# Altium project pca10100.PrjPCB (part 1 of 4)
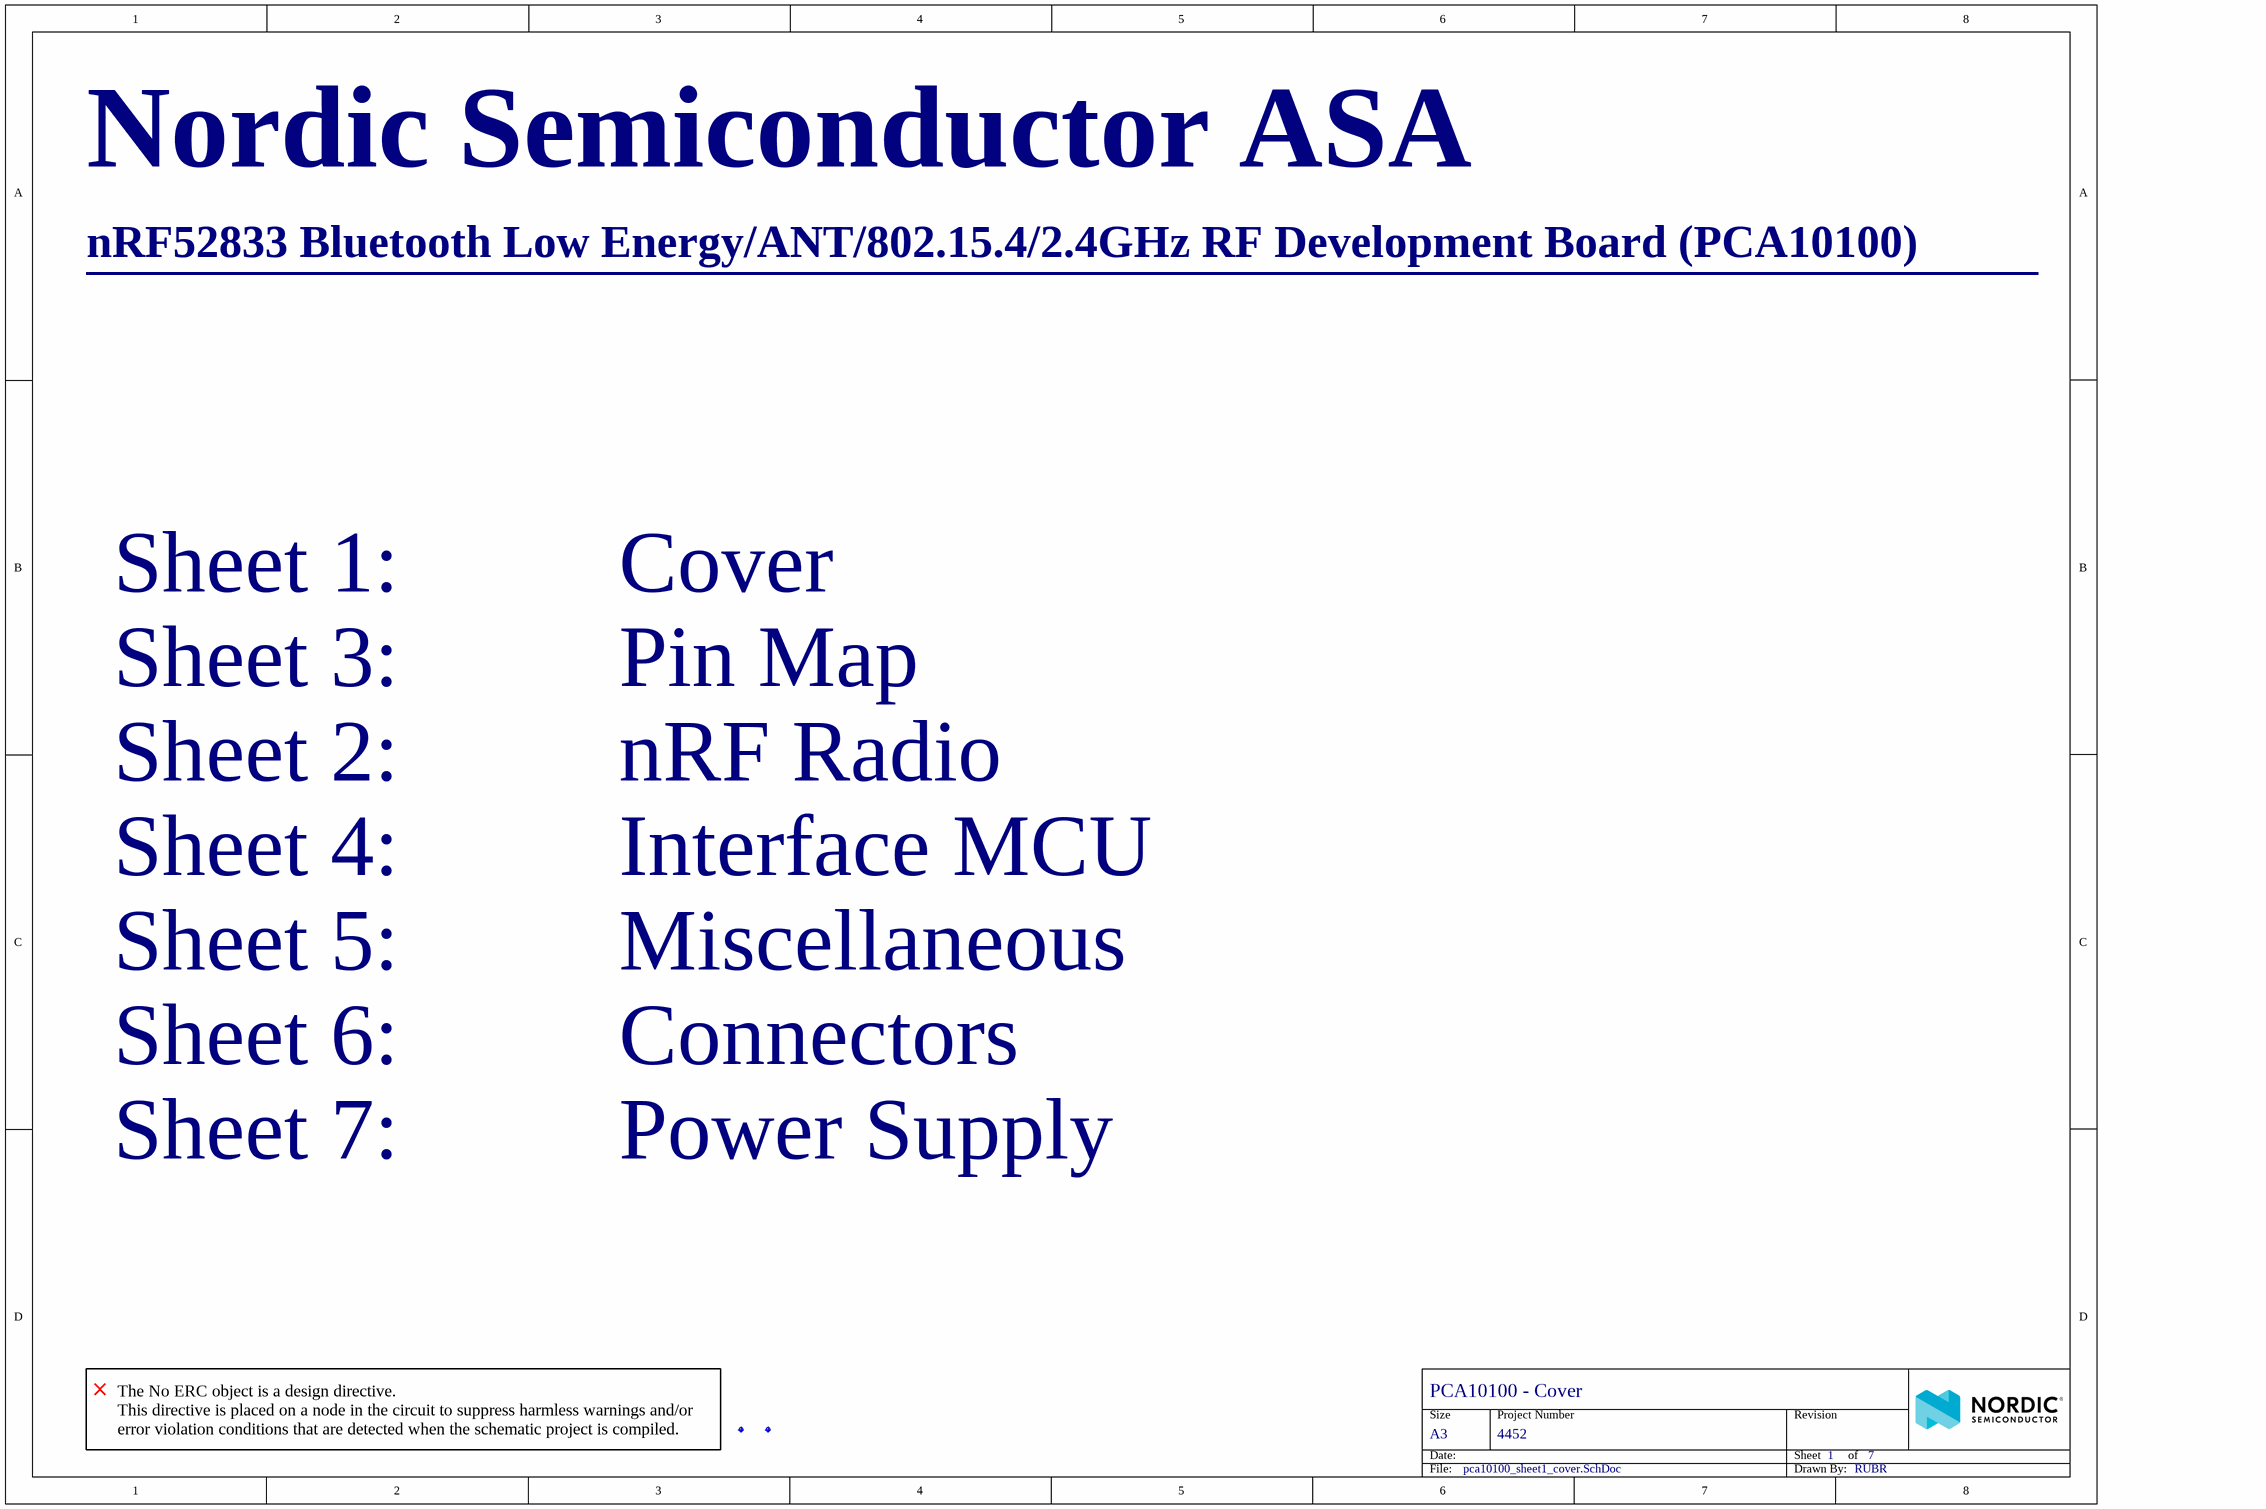
[diagram p0: pca10100_sheet1_cover.SchDoc]
Author: RUBR; BoardThickness: 1.6mm; BoardTitle: nRF52833 Bluetooth Smart/ANT/802.15.4/2.4GHz RF Development Board; NrOfLayers: 4; Organization: Nordic Semiconductor; PCAName: PCA10100; PCBNumber: 400442; PCBRevision: 0402RUBR; PCBStackup: 4001; ProjectNumber: 4452; Rev: 1.1.0; SilkscreenColor: White; SoldermaskColor: Blue; SurfaceFinish: ENIG Gold
7 sheets, 336 parts. Net scope: flat (ports and power ports of the same name join across sheets).
Board file: 400442.PcbDoc
Sheets:
  pca10100_sheet1_cover.SchDoc
  pca10100_sheet2_nrf52833_mcu.SchDoc
  pca10100_sheet3_pin_map.SchDoc
  pca10100_sheet4_interface_mcu.SchDoc
  pca10100_sheet5_misc.SchDoc
  pca10100_sheet6_connectors.SchDoc
  pca10100_sheet7_power_supply.SchDoc

## Sheet pca10100_sheet1_cover.SchDoc: PCA10100 - Cover
size A3; Organization: Nordic Semiconductor; DocumentNumber: 1; Revision: 1.1.0; SheetNumber: 1; SheetTotal: 7; Author: RUBR; CompanyName: Nordic Semiconductor; DrawnBy: RUBR

### Parts
Fid1  Fiducial mark  [Fiducial]  (value not drawn)
Fid2  Fiducial mark  [Fiducial]  (value not drawn)

### Notes on the sheet
- Nordic Semiconductor ASA
- nRF52833 Bluetooth Low Energy/ANT/802.15.4/2.4GHz RF Development Board (PCA10100)
- ________________________________________________________________
- Sheet 1:          Cover
- Sheet 3:          Pin Map
- Sheet 2:          nRF Radio
- Sheet 4:          Interface MCU
- Sheet 5:          Miscellaneous
- Sheet 6:          Connectors
- Sheet 7:          Power Supply
- (near Fid1) The No ERC object is a design directive.
  This directive is placed on a node in the circuit to suppress harmless warnings and/or error violation conditions that are detected when the schematic project is compiled.
- Size
- Date:
- A3
- Project Number
- Sheet         of
- Revision
- File:
- Drawn By:

### Library data of the parts
Fid1 Fid2 = Fid-Mark: Manufacturer: N.A.; Value: N.A.; Pad Count: 1; Part Number: Fid-Mark; Manufacturer Part Number: N.A.; LatestRevisionDate: 2009-12-12; Published: 2009-12-12; Note: N.A.; Artikkelnr Noca: N.A.; Footprint Doc: Fiducial; Part number IPS: N.A.; ComponentLink1URL: N.A.; ComponentLink1Description: Datasheet; ComponentLink2URL: N.A.; ComponentLink2Description: Supplier link; HelpURL: N.A.; Supplier 1: N.A.; Supplier Part Number 1: N.A.; Supplier 2: N.A.; Supplier Part Number 2: N.A.; Component Class: Connectors; PartId: 100500073

## Sheet pca10100_sheet2_nrf52833_mcu.SchDoc: PCA10100 - nRF52833 MCU
size A3; Organization: Nordic Semiconductor; DocumentNumber: 2; Revision: 1.1.0; SheetNumber: 2; SheetTotal: 7; Author: RUBR; CompanyName: Nordic Semiconductor; DrawnBy: RUBR
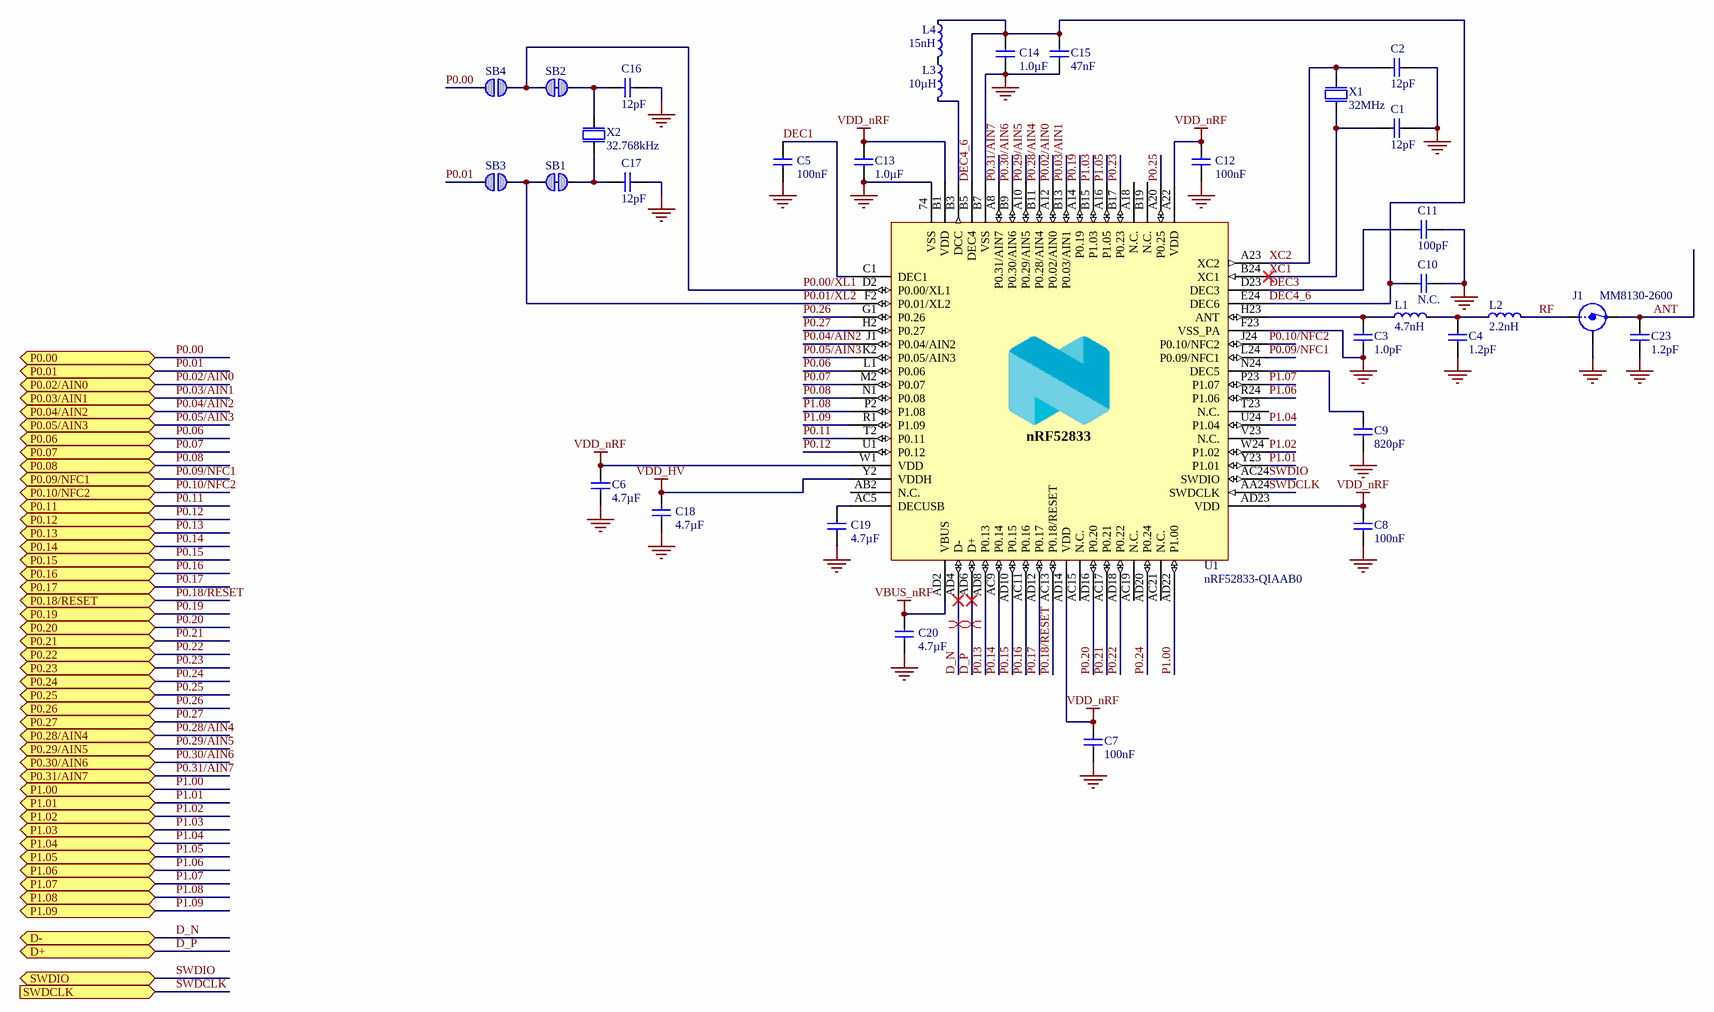
[diagram p1: pca10100_sheet2_nrf52833_mcu.SchDoc]

### Parts
C1  12pF  [CAPC1005X04L]
C2  12pF  [CAPC1005X04L]
C3  1.0pF  [CAPC1005X04L]
C4  1.2pF  [CAPC1005X04L]
C5  100nF  [CAPC1005X04L]
C6  4.7µF  [CAPC1608X06L]
C7  100nF  [CAPC1005X04L]
C8  100nF  [CAPC1005X04L]
C9  820pF  [CAPC1005X04L]
C10  N.C.  [CAPC1005X04L_NC]
C11  100pF  [CAPC1005X04L]
C12  100nF  [CAPC1005X04L]
C13  1.0µF  [CAPC1608X06L]
C14  1.0µF  [CAPC1608X06L]
C15  47nF  [CAPC1005X04L]
C16  12pF  [CAPC1005X04L]
C17  12pF  [CAPC1005X04L]
C18  4.7µF  [CAPC1608X06L]
C19  4.7µF  [CAPC1608X06L]
C20  4.7µF  [CAPC1608X06L]
C23  1.2pF  [CAPC1005X04L]
J1  MM8130-2600  [COAXIAL-SWF]
L1  4.7nH  [INDC1005X04L]
L2  2.2nH  [INDC1005X04L]
L3  10µH  [INDC1608X06L]
L4  15nH  [INDC1005X04L]
SB1  Solderbridge  [Solderbridge_Shorted]  (value not drawn)  (net tie, no BOM)
SB2  Solderbridge  [Solderbridge_Shorted]  (value not drawn)  (net tie, no BOM)
SB3  Solderbridge  [Solderbridge]  (value not drawn)  (no BOM)
SB4  Solderbridge  [Solderbridge]  (value not drawn)  (no BOM)
U1  nRF52833-QIAAB0  [AQFN50P700X700X85_HS-74N]
X1  32MHz  [BT-XTAL_2016]
X2  32.768kHz  [XTAL_3215]

### Ports
D+ (bidir), D- (bidir), P0.00 (bidir), P0.01 (bidir), P0.02/AIN0 (bidir), P0.03/AIN1 (bidir), P0.04/AIN2 (bidir), P0.05/AIN3 (bidir), P0.06 (bidir), P0.07 (bidir), P0.08 (bidir), P0.09/NFC1 (bidir), P0.10/NFC2 (bidir), P0.11 (bidir), P0.12 (bidir), P0.13 (bidir), P0.14 (bidir), P0.15 (bidir), P0.16 (bidir), P0.17 (bidir), P0.18/RESET (bidir), P0.19 (bidir), P0.20 (bidir), P0.21 (bidir), P0.22 (bidir), P0.23 (bidir), P0.24 (bidir), P0.25 (bidir), P0.26 (bidir), P0.27 (bidir), P0.28/AIN4 (bidir), P0.29/AIN5 (bidir), P0.30/AIN6 (bidir), P0.31/AIN7 (bidir), P1.00 (bidir), P1.01 (bidir), P1.02 (bidir), P1.03 (bidir), P1.04 (bidir), P1.05 (bidir), P1.06 (bidir), P1.07 (bidir), P1.08 (bidir), P1.09 (bidir), SWDCLK (in), SWDIO (bidir)

### Nets
GND: C1.2 C2.2 C3.1 C4.1 C5.2 C6.2 C7.2 C8.2 C9.2 C10.1 C11.2 C12.2 C13.2 C14.1 C15.2 C16.1 C17.1 C18.2 C19.2 C20.2 C23.2 J1.2(Shield) U1.74(VSS) U1.B7(VSS) U1.F23(VSS_PA) X1.2(GND) X1.4(GND)
VBUS_nRF: C20.1 U1.AD2(VBUS)
VDD_HV: C18.1 U1.Y2(VDDH)
VDD_nRF: C6.1 C7.1 C8.1 C12.1 C13.1 U1.A22(VDD) U1.AD14(VDD) U1.AD23(VDD) U1.B1(VDD) U1.W1(VDD)
ANT: C23.1 J1.3(OUT)
D_N: U1.AD4(D-) ; port D-  [project net D*_N]
D_P: U1.AD6(D+) ; port D+  [project net D*_P]
DEC1: C5.1 U1.C1(DEC1)
DEC3: C11.1 U1.D23(DEC3)
DEC4_6: C10.2 C14.2 C15.1 L4.1 U1.B5(DEC4) U1.E24(DEC6)
P0.00: SB4.2 ; port P0.00
P0.00/XL1: SB2.2 SB4.1 U1.D2(P0.00/XL1)
P0.01: SB3.2 ; port P0.01
P0.01/XL2: SB1.2 SB3.1 U1.F2(P0.01/XL2)
P0.02/AIN0: U1.A12(P0.02/AIN0) ; port P0.02/AIN0
P0.03/AIN1: U1.B13(P0.03/AIN1) ; port P0.03/AIN1
P0.04/AIN2: U1.J1(P0.04/AIN2) ; port P0.04/AIN2
P0.05/AIN3: U1.K2(P0.05/AIN3) ; port P0.05/AIN3
P0.06: U1.L1(P0.06) ; port P0.06
P0.07: U1.M2(P0.07) ; port P0.07
P0.08: U1.N1(P0.08) ; port P0.08
P0.09/NFC1: U1.L24(P0.09/NFC1) ; port P0.09/NFC1
P0.10/NFC2: U1.J24(P0.10/NFC2) ; port P0.10/NFC2
P0.11: U1.T2(P0.11) ; port P0.11
P0.12: U1.U1(P0.12) ; port P0.12
P0.13: U1.AD8(P0.13) ; port P0.13
P0.14: U1.AC9(P0.14) ; port P0.14
P0.15: U1.AD10(P0.15) ; port P0.15
P0.16: U1.AC11(P0.16) ; port P0.16
P0.17: U1.AD12(P0.17) ; port P0.17
P0.18/RESET: U1.AC13(P0.18/RESET) ; port P0.18/RESET
P0.19: U1.A14(P0.19) ; port P0.19
P0.20: U1.AD16(P0.20) ; port P0.20
P0.21: U1.AC17(P0.21) ; port P0.21
P0.22: U1.AD18(P0.22) ; port P0.22
P0.23: U1.B17(P0.23) ; port P0.23
P0.24: U1.AD20(P0.24) ; port P0.24
P0.25: U1.A20(P0.25) ; port P0.25
P0.26: U1.G1(P0.26) ; port P0.26
P0.27: U1.H2(P0.27) ; port P0.27
P0.28/AIN4: U1.B11(P0.28/AIN4) ; port P0.28/AIN4
P0.29/AIN5: U1.A10(P0.29/AIN5) ; port P0.29/AIN5
P0.30/AIN6: U1.B9(P0.30/AIN6) ; port P0.30/AIN6
P0.31/AIN7: U1.A8(P0.31/AIN7) ; port P0.31/AIN7
P1.00: U1.AD22(P1.00) ; port P1.00
P1.01: U1.Y23(P1.01) ; port P1.01
P1.02: U1.W24(P1.02) ; port P1.02
P1.03: U1.B15(P1.03) ; port P1.03
P1.04: U1.U24(P1.04) ; port P1.04
P1.05: U1.A16(P1.05) ; port P1.05
P1.06: U1.R24(P1.06) ; port P1.06
P1.07: U1.P23(P1.07) ; port P1.07
P1.08: U1.P2(P1.08) ; port P1.08
P1.09: U1.R1(P1.09) ; port P1.09
RF: J1.1(IN) L2.2
SWDCLK: U1.AA24(SWDCLK) ; port SWDCLK
SWDIO: U1.AC24(SWDIO) ; port SWDIO
XC1: C1.1 U1.B24(XC1) X1.1(inp)
XC2: C2.1 U1.A23(XC2) X1.3(out)
NetC3_2: C3.2 L1.1 U1.H23(ANT)
NetC4_2: C4.2 L1.2 L2.1
NetC9_1: C9.1 U1.N24(DEC5)
NetC16_2: C16.2 SB2.1 X2.1(inp)
NetC17_2: C17.2 SB1.1 X2.2(out)
NetC19_1: C19.1 U1.AC5(DECUSB)
NetL3_1: L3.1 L4.2
NetL3_2: L3.2 U1.B3(DCC)

Not connected (* = marked no-connect by the designer): U1 A18(N.C.) AB2(N.C.) AC15(N.C.) AC19(N.C.) AC21(N.C.) B19(N.C.) T23(N.C.) V23(N.C.)

### Layout directives
differential pair: D*_N, D*_P

### Notes on the sheet
- Size
- Date:
- A3
- Project Number
- Sheet         of
- Revision
- File:
- Drawn By:
- (in symbol nRF52833-QIAAB0) nRF52833

### Library data of the parts
C1 C2 C16 C17 = C0402-12p: Capacitor, NP0, ±2%; Manufacturer: N.A.; Part number IPS: 00000002398; Note: 50V; Artikkelnr Noca: 20029159; Pad Count: 2; Part Number: C0402-12p; LatestRevisionDate: 2011-05-11; Published: 2009-05-08; Value: 12pF; Footprint Doc: 0402; Manufacturer Part Number: N.A.; ComponentLink1URL: N.A.; ComponentLink1Description: Datasheet; ComponentLink2URL: N.A.; ComponentLink2Description: Supplier link; HelpURL: N.A.; Supplier 1: N.A.; Supplier Part Number 1: N.A.; Supplier 2: N.A.; Supplier Part Number 2: N.A.; Component Class: Capacitors; PartId: 100200137
C3 = C0402-1.0p: Capacitor, NP0, ±0.1pF; Manufacturer: N.A.; Part number IPS: 00000000301; Note: 50V; Artikkelnr Noca: 20029140; Pad Count: 2; Part Number: C0402-1.0p; LatestRevisionDate: 2020-04-28; Published: 2009-05-08; Value: 1.0pF; Footprint Doc: 0402; Manufacturer Part Number: N.A.; ComponentLink1URL: N.A.; ComponentLink1Description: Datasheet; ComponentLink2URL: N.A.; ComponentLink2Description: Supplier link; HelpURL: N.A.; Supplier 1: Digi-Key; Supplier Part Number 1: 490-6073-1-ND; Supplier 2: N.A.; Supplier Part Number 2: N.A.; Component Class: Capacitors; PartId: 100200118
C4 C23 = C0402-1.2p: Capacitor, NP0, ±0.1pF; Manufacturer: N.A.; Part number IPS: 00000005410; Note: 50V; Artikkelnr Noca: 20029157; Pad Count: 2; Part Number: C0402-1.2p; LatestRevisionDate: 2011-05-11; Published: 2009-05-08; Value: 1.2pF; Footprint Doc: 0402; Manufacturer Part Number: N.A.; ComponentLink1URL: N.A.; ComponentLink1Description: Datasheet; ComponentLink2URL: N.A.; ComponentLink2Description: Supplier link; HelpURL: N.A.; Supplier 1: N.A.; Supplier Part Number 1: N.A.; Supplier 2: N.A.; Supplier Part Number 2: N.A.; Component Class: Capacitors; PartId: 100200119
C5 C7 C8 C12 = C0402-100n: Capacitor, X7R, ±10%; Manufacturer: N.A.; Part number IPS: 00000005296; Note: 16V; Artikkelnr Noca: 20039200; Pad Count: 2; Part Number: C0402-100n; LatestRevisionDate: 2009-11-23; Published: 2009-05-08; Value: 100nF; Footprint Doc: 0402; Manufacturer Part Number: N.A.; ComponentLink1URL: N.A.; ComponentLink1Description: Datasheet; ComponentLink2URL: N.A.; ComponentLink2Description: Supplier link; HelpURL: N.A.; Supplier 1: N.A.; Supplier Part Number 1: N.A.; Supplier 2: N.A.; Supplier Part Number 2: N.A.; Component Class: Capacitors; PartId: 100200184
C6 C19 = C0603-4µ7-6.3V-X7R: Capacitor, X7R, ±10%, 6.3V; Manufacturer: Samsung Electro-Mechanics America; Manufacturer Part Number: CL10B475KQ8NQNC; Part number IPS: 00000002541; Artikkelnr Noca: 20039473; Pad Count: 2; Part Number: C0603-4µ7-6.3V-X7R; LatestRevisionDate: 2015-06-10; Published: 2015-06-10; Value: 4.7µF; Note: 6.3V; Footprint Doc: 0603; ComponentLink1URL: N.A.; ComponentLink1Description: Datasheet; ComponentLink2URL: N.A.; ComponentLink2Description: Supplier link; HelpURL: http://media.digikey.com/pdf/Data%20Sheets/Samsung%20PDFs/CL10B475KQ8NQNC_Spec.pdf; Supplier 1: Digi-Key; Supplier Part Number 1: 1276-2087-1-ND; Supplier 2: N.A.; Supplier Part Number 2: N.A.; Component Class: Capacitors; PartId: 100200350
C9 = C0402-820p: Capacitor, NP0, ±5%, 50V; Manufacturer: N.A.; Part number IPS: 00000004365; Artikkelnr Noca: 20029219; Pad Count: 2; Part Number: C0402-820p; LatestRevisionDate: 2020-10-13; Published: 2009-05-08; Value: 820pF; Note: 50V; Footprint Doc: 0402; Manufacturer Part Number: N.A.; ComponentLink1URL: N.A.; ComponentLink1Description: Datasheet; ComponentLink2URL: N.A.; ComponentLink2Description: Supplier link; HelpURL: N.A.; Supplier 1: N.A.; Supplier Part Number 1: N.A.; Supplier 2: N.A.; Supplier Part Number 2: N.A.; Component Class: Capacitors; PartId: 100200161
C10 = C0402-N.C.: Not mounted; Manufacturer: N.A.; Note: Chip Cap; Assembly: Not mounted; Pad Count: 2; Part Number: C0402-N.C.; LatestRevisionDate: 2009-05-08; Published: 2009-05-08; Value: N.C.; Footprint Doc: 0402; Manufacturer Part Number: N.A.; Artikkelnr Noca: N.A.; Part number IPS: N.A.; ComponentLink1URL: N.A.; ComponentLink1Description: Datasheet; ComponentLink2URL: N.A.; ComponentLink2Description: Supplier link; HelpURL: N.A.; Supplier 1: N.A.; Supplier Part Number 1: N.A.; Supplier 2: N.A.; Supplier Part Number 2: N.A.; Component Class: Capacitors; PartId: 100200105
C11 = C0402-100p: Capacitor, NP0, ±5%; Manufacturer: N.A.; Part number IPS: 00000002361; Note: 50V; Artikkelnr Noca: 20029135; Pad Count: 2; Part Number: C0402-100p; LatestRevisionDate: 2009-05-08; Published: 2009-05-08; Value: 100pF; Footprint Doc: 0402; Manufacturer Part Number: N.A.; ComponentLink1URL: N.A.; ComponentLink1Description: Datasheet; ComponentLink2URL: N.A.; ComponentLink2Description: Supplier link; HelpURL: N.A.; Supplier 1: N.A.; Supplier Part Number 1: N.A.; Supplier 2: N.A.; Supplier Part Number 2: N.A.; Component Class: Capacitors; PartId: 100200148
C13 C14 = C0603-1µ0: Capacitor, X7R, ±10%; Manufacturer: N.A.; Part number IPS: 00000000616; Note: 16V; Artikkelnr Noca: 20039282; Pad Count: 2; Part Number: C0603-1µ0; LatestRevisionDate: 2013-06-05; Published: 2009-05-08; Value: 1.0µF; Footprint Doc: 0603; Manufacturer Part Number: N.A.; ComponentLink1URL: N.A.; ComponentLink1Description: Datasheet; ComponentLink2URL: N.A.; ComponentLink2Description: Supplier link; HelpURL: N.A.; Supplier 1: N.A.; Supplier Part Number 1: N.A.; Supplier 2: N.A.; Supplier Part Number 2: N.A.; Component Class: Capacitors; PartId: 100200271
C15 = C0402-47n: Capacitor, X7R, ±10%, 10V; Manufacturer: N.A.; Part number IPS: 00000003143; Note: Chip Cap 10%; Artikkelnr Noca: 20039389; Pad Count: 2; Part Number: C0402-47n; LatestRevisionDate: 2020-10-13; Published: 2009-05-08; Value: 47nF; Footprint Doc: 0402; Manufacturer Part Number: N.A.; ComponentLink1URL: N.A.; ComponentLink1Description: Datasheet; ComponentLink2URL: N.A.; ComponentLink2Description: Supplier link; HelpURL: N.A.; Supplier 1: N.A.; Supplier Part Number 1: N.A.; Supplier 2: N.A.; Supplier Part Number 2: N.A.; Component Class: Capacitors; PartId: 100200180
C18 C20 = C0603-4µ7-10V-X7S: Capacitor, X7S, ±10%, 10V; Manufacturer: N.A.; Part number IPS: 00000001779; Artikkelnr Noca: 20030013; Pad Count: 2; Part Number: C0603-4µ7-10V-X7S; LatestRevisionDate: 2016-08-15; Published: 2016-08-15; Value: 4.7µF; Note: 10V; Footprint Doc: 0603; Manufacturer Part Number: N.A.; ComponentLink1URL: N.A.; ComponentLink1Description: Datasheet; ComponentLink2URL: N.A.; ComponentLink2Description: Supplier link; HelpURL: N.A.; Supplier 1: Digi-Key; Supplier Part Number 1: 445-14258-1-ND; Supplier 2: N.A.; Supplier Part Number 2: N.A.; Component Class: Capacitors; PartId: 100200351
J1 = MM8130-2600: Coaxial Connector with Switch; Manufacturer: Murata; Part number IPS: 00000009955; Note: N.A.; Artikkelnr Noca: 55029011; Pad Count: 3; Part Number: MM8130-2600; Manufacturer Part Number: MM8130-2600; LatestRevisionDate: 2014-04-24; Published: 2014-04-24; Value: MM8130-2600; Footprint Doc: COAXIAL-SWF; ComponentLink1URL: N.A.; ComponentLink1Description: Datasheet; ComponentLink2URL: N.A.; ComponentLink2Description: Supplier link; HelpURL: http://www.murata.com/products/catalog/pdf/o33e.pdf; Supplier 1: Digi-Key; Supplier Part Number 1: 490-4981-1-ND; Supplier 2: Mouser; Supplier Part Number 2: 81-MM8130-2600RA2; Component Class: Connectors; PartId: 100500400
L1 = L0402-4n7: Inductor, 160mA, ±0.1nH; Manufacturer: Murata; Manufacturer Part Number: LQP15MN4N7B02D; Part number IPS: 00000004366; Note: High frequency chip inductor ±5%; Artikkelnr Noca: 33029164; Pad Count: 2; Part Number: L0402-4n7; LatestRevisionDate: 2012-09-19; Published: 2009-05-08; Value: 4.7nH; Footprint Doc: 0402; ComponentLink1URL: N.A.; ComponentLink1Description: Datasheet; ComponentLink2URL: N.A.; ComponentLink2Description: Supplier link; HelpURL: http://search.murata.co.jp/Ceramy/image/img/PDF/ENG/L0075S0084LQP15M.pdf; Supplier 1: Digi-Key; Supplier Part Number 1: 490-1132-1-ND; Supplier 2: N.A.; Supplier Part Number 2: N.A.; Component Class: Inductors; PartId: 100300050
L2 = L0402-2n2: Inductor, 220mA, ±0.1nH; Manufacturer: Murata; Manufacturer Part Number: LQP15MN2N2B02D; Part number IPS: N.A.; Note: High frequency chip inductor ±5%; Artikkelnr Noca: 33029257; Pad Count: 2; Part Number: L0402-2n2; LatestRevisionDate: 2012-09-19; Published: 2009-05-08; Value: 2.2nH; Footprint Doc: 0402; ComponentLink1URL: N.A.; ComponentLink1Description: Datasheet; ComponentLink2URL: N.A.; ComponentLink2Description: Supplier link; HelpURL: http://search.murata.co.jp/Ceramy/image/img/PDF/ENG/L0075S0084LQP15M.pdf; Supplier 1: Digi-Key; Supplier Part Number 1: 490-1128-1-ND; Supplier 2: N.A.; Supplier Part Number 2: N.A.; Component Class: Inductors; PartId: 100300044
L3 = L0603-10µ-TDK: Inductor, 250mA, ±20%, 1.05ohm. -55°C ~ 125°C; Manufacturer: TDK Corporation; Manufacturer Part Number: MLZ1608M100WTD25; Note: N.A.; Pad Count: 2; Part Number: L0603-10µ-TDK; LatestRevisionDate: 2012-09-19; Published: 2019-05-06; Value: 10µH; Footprint Doc: 0603; ComponentLink1Description: Datasheet; ComponentLink2Description: Supplier link; Artikkelnr Noca: N.A.; Part number IPS: N.A.; ComponentLink1URL: N.A.; ComponentLink2URL: N.A.; HelpURL: https://product.tdk.com/info/en/catalog/datasheets/inductor_automotive_decoupling_mlz1608_en.pdf; Supplier 1: Digi-Key; Supplier Part Number 1: 445-175588-1-ND; Supplier 2: Mouser; Supplier Part Number 2: 810-MLZ1608M100WTD25; Component Class: Inductors; PartId: 100300079
L4 = L0402-15n: Inductor, 320mA, ±5%; Manufacturer: Taiyo Yuden; Manufacturer Part Number: HK100515NJ-T; Part number IPS: 00000001262; Note: High frequency chip inductor ±10%; Artikkelnr Noca: 33029323; Pad Count: 2; Part Number: L0402-15n; LatestRevisionDate: 2012-09-19; Published: 2010-07-12; Value: 15nH; Footprint Doc: 0402; ComponentLink1Description: Datasheet; ComponentLink2Description: Supplier link; ComponentLink1URL: N.A.; ComponentLink2URL: N.A.; HelpURL: http://www.yuden.co.jp/productdata/catalog/en/mlci04_e.pdf; Supplier 1: Digi-Key; Supplier Part Number 1: 587-1521-1-ND; Supplier 2: Farnell; Supplier Part Number 2: 658-1328; Component Class: Inductors; PartId: 100300056
SB1 SB2 = Solderbridge Shorted: Shorted Solderbridge; Manufacturer: N.A.; Pad Count: 2; Part Number: Solderbridge Shorted; Manufacturer Part Number: N.A.; LatestRevisionDate: 2012-08-07; Published: 2012-08-07; Value: Solderbridge; Note: N.A.; Artikkelnr Noca: N.A.; Footprint Doc: Solderbridge_Shorted; Part number IPS: N.A.; ComponentLink1URL: N.A.; ComponentLink1Description: Datasheet; ComponentLink2URL: N.A.; ComponentLink2Description: Supplier link; HelpURL: N.A.; Supplier 1: N.A.; Supplier Part Number 1: N.A.; Supplier 2: N.A.; Supplier Part Number 2: N.A.; Component Class: Connectors; PartId: 100500459
SB3 SB4 = Solderbridge: Manufacturer: N.A.; Pad Count: 2; Part Number: Solderbridge; Manufacturer Part Number: N.A.; LatestRevisionDate: 2009-12-14; Published: 2009-12-14; Value: Solderbridge; Note: N.A.; Artikkelnr Noca: N.A.; Footprint Doc: Solderbridge; Part number IPS: N.A.; ComponentLink1URL: N.A.; ComponentLink1Description: Datasheet; ComponentLink2URL: N.A.; ComponentLink2Description: Supplier link; HelpURL: N.A.; Supplier 1: N.A.; Supplier Part Number 1: N.A.; Supplier 2: N.A.; Supplier Part Number 2: N.A.; Component Class: Connectors; PartId: 100500458
U1 = nRF52833-QIAAB0: Multi-protocol Bluetooth Low Energy, IEEE 802.15.4, ANT and 2.4GHz proprietary system-on-chip; Manufacturer: Nordic Semiconductor; Note: N.A.; Pad Count: 73; Part Number: nRF52833-QIAAB0; Manufacturer Part Number: nRF52833-QIAAB0; LatestRevisionDate: 2021-08-30; Published: 2021-08-30; Value: nRF52833-QIAAB0; Artikkelnr Noca: N.A.; Footprint Doc: AQFN-73; Part number IPS: N.A.; ComponentLink1URL: N.A.; ComponentLink1Description: Datasheet; ComponentLink2URL: N.A.; ComponentLink2Description: Supplier link; HelpURL: N.A.; Supplier 1: Nordic Semiconductor; Supplier Part Number 1: nRF52833-QIAAB0; Supplier 2: N.A.; Supplier Part Number 2: N.A.; Component Class: nRF_Devices; Author: rsk; Part number Norautron: N.A.
X1 = XTAL_SMD2016_32MHz_8pF_Golledge: XTAL SMD 2016, 32MHz, Cl=8pF, Tol: ±10ppm, Stab: ±15ppm; Manufacturer Part Number: MP06003; Part number IPS: 00000001431; Note: XTAL SMD 32.000MHz; Artikkelnr Noca: 22010050; Pad Count: 4; Part Number: XTAL_SMD2016_32MHz_8pF_Golledge; LatestRevisionDate: 2016-11-02; Published: 2016-11-02; Value: 32MHz; Footprint Doc: XTAL_2016; Manufacturer: Golledge; ComponentLink1URL: N.A.; ComponentLink1Description: Datasheet; ComponentLink2URL: N.A.; ComponentLink2Description: Supplier link; HelpURL: \\hizz\pro\app9717\Datasheet\crystals\Golledge\mp06003.pdf; Supplier 1: Link Nordic; Supplier Part Number 1: N.A.; Supplier 2: N.A.; Supplier Part Number 2: N.A.; Component Class: Oscillators; PartId: 101600041
X2 = XTAL_SMD3215_32.768kHz_9pF_NDK: XTAL SMD 3215, 32.768kHz, 9pF, ±20ppm; Manufacturer: NDK; Manufacturer Part Number: NX3215SA-32.768K-STD-MUA-9; Part number IPS: 00000005419; Note: XTAL SMD 32.768kHz; Artikkelnr Noca: 22010049; Pad Count: 2; Part Number: XTAL_SMD3215_32.768kHz_9pF_NDK; LatestRevisionDate: 2017-10-23; Published: 2017-10-23; Value: 32.768kHz; Footprint Doc: XTAL_3215; ComponentLink1URL: N.A.; ComponentLink1Description: Datasheet; ComponentLink2URL: N.A.; ComponentLink2Description: Supplier link; HelpURL: N.A.; Supplier 1: N.A.; Supplier Part Number 1: N.A.; Supplier 2: N.A.; Supplier Part Number 2: N.A.; Component Class: Oscillators; PartId: 101600019

## Sheet pca10100_sheet3_pin_map.SchDoc: PCA10100 - Pin Map
size A3; Organization: Nordic Semiconductor; DocumentNumber: 3; Revision: 1.1.0; SheetNumber: 3; SheetTotal: 7; Author: RUBR; CompanyName: Nordic Semiconductor; DrawnBy: RUBR
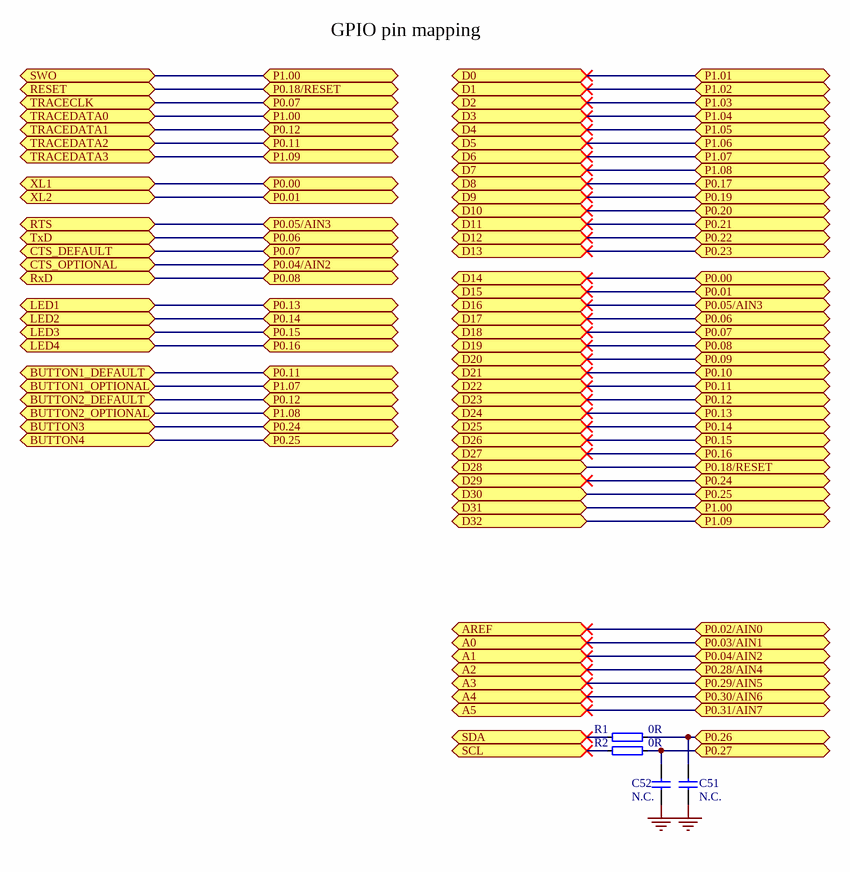
[diagram p2: pca10100_sheet3_pin_map.SchDoc]

### Parts
C51  N.C.  [CAPC0603X03L_C_NC]
C52  N.C.  [CAPC0603X03L_C_NC]
R1  0R  [RESC0603X03L_C]
R2  0R  [RESC0603X03L_C]

### Ports
A0 (bidir), A1 (bidir), A2 (bidir), A3 (bidir), A4 (bidir), A5 (bidir), AREF (bidir), BUTTON1_DEFAULT (bidir), BUTTON1_OPTIONAL (bidir), BUTTON2_DEFAULT (bidir), BUTTON2_OPTIONAL (bidir), BUTTON3 (bidir), BUTTON4 (bidir), CTS_DEFAULT (bidir), CTS_OPTIONAL (bidir), D0 (bidir), D1 (bidir), D2 (bidir), D3 (bidir), D4 (bidir), D5 (bidir), D6 (bidir), D7 (bidir), D8 (bidir), D9 (bidir), D10 (bidir), D11 (bidir), D12 (bidir), D13 (bidir), D14 (bidir), D15 (bidir), D16 (bidir), D17 (bidir), D18 (bidir), D19 (bidir), D20 (bidir), D21 (bidir), D22 (bidir), D23 (bidir), D24 (bidir), D25 (bidir), D26 (bidir), D27 (bidir), D28 (bidir), D29 (bidir), D30 (bidir), D31 (bidir), D32 (bidir), LED1 (bidir), LED2 (bidir), LED3 (bidir), LED4 (bidir), P0.00 (bidir), P0.01 (bidir), P0.02/AIN0 (bidir), P0.03/AIN1 (bidir), P0.04/AIN2 (bidir), P0.05/AIN3 (bidir), P0.06 (bidir), P0.07 (bidir), P0.08 (bidir), P0.09 (bidir), P0.10 (bidir), P0.11 (bidir), P0.12 (bidir), P0.13 (bidir), P0.14 (bidir), P0.15 (bidir), P0.16 (bidir), P0.17 (bidir), P0.18/RESET (bidir), P0.19 (bidir), P0.20 (bidir), P0.21 (bidir), P0.22 (bidir), P0.23 (bidir), P0.24 (bidir), P0.25 (bidir), P0.26 (bidir), P0.27 (bidir), P0.28/AIN4 (bidir), P0.29/AIN5 (bidir), P0.30/AIN6 (bidir), P0.31/AIN7 (bidir), P1.00 (bidir), P1.01 (bidir), P1.02 (bidir), P1.03 (bidir), P1.04 (bidir), P1.05 (bidir), P1.06 (bidir), P1.07 (bidir), P1.08 (bidir), P1.09 (bidir), RESET (bidir), RTS (bidir), RxD (bidir), SCL (bidir), SDA (bidir), SWO (bidir), TRACECLK (bidir), TRACEDATA0 (bidir), TRACEDATA1 (bidir), TRACEDATA2 (bidir), TRACEDATA3 (bidir), TxD (bidir), XL1 (bidir), XL2 (bidir)

### Nets
GND: C51.1 C52.2
P0.00: port P0.00, port XL1, port D14
P0.01: port P0.01, port XL2, port D15
P0.02/AIN0: port AREF, port P0.02/AIN0
P0.03/AIN1: port A0, port P0.03/AIN1
P0.04/AIN2: port P0.04/AIN2, port CTS_OPTIONAL, port A1
P0.05/AIN3: port RTS, port D16, port P0.05/AIN3
P0.06: port TxD, port P0.06, port D17
P0.07: port P0.07, port TRACECLK, port CTS_DEFAULT, port D18
P0.08: port RxD, port P0.08, port D19
P0.11: port TRACEDATA2, port P0.11, port BUTTON1_DEFAULT, port D22
P0.12: port TRACEDATA1, port P0.12, port BUTTON2_DEFAULT, port D23
P0.13: port P0.13, port LED1, port D24
P0.14: port P0.14, port LED2, port D25
P0.15: port P0.15, port LED3, port D26
P0.16: port P0.16, port LED4, port D27
P0.17: port D8, port P0.17
P0.18/RESET: port RESET, port P0.18/RESET, port D28
P0.19: port D9, port P0.19
P0.20: port D10, port P0.20
P0.21: port D11, port P0.21
P0.22: port D12, port P0.22
P0.23: port D13, port P0.23
P0.24: port P0.24, port BUTTON3, port D29
P0.25: port P0.25, port BUTTON4, port D30
P0.26: C51.2 R1.2 ; port P0.26
P0.27: C52.1 R2.2 ; port P0.27
P0.28/AIN4: port A2, port P0.28/AIN4
P0.29/AIN5: port A3, port P0.29/AIN5
P0.30/AIN6: port A4, port P0.30/AIN6
P0.31/AIN7: port A5, port P0.31/AIN7
P1.00: port TRACEDATA0, port SWO, port P1.00, port D31
P1.01: port P1.01, port D0
P1.02: port P1.02, port D1
P1.03: port P1.03, port D2
P1.04: port P1.04, port D3
P1.05: port P1.05, port D4
P1.06: port P1.06, port D5
P1.07: port P1.07, port BUTTON1_OPTIONAL, port D6
P1.08: port P1.08, port BUTTON2_OPTIONAL, port D7
P1.09: port TRACEDATA3, port P1.09, port D32
NetP4_9: R1.1 ; port SDA
NetP4_10: R2.1 ; port SCL
NetP6_7: port D20, port P0.09
NetP6_8: port D21, port P0.10

### Notes on the sheet
- GPIO pin mapping
- Size
- Date:
- A3
- Project Number
- Sheet         of
- Revision
- File:
- Drawn By:

### Library data of the parts
C51 C52 = C0201-N.C.: Not mounted; Manufacturer: N.A.; Assembly: Not mounted; Note: Chip Cap; Pad Count: 2; Part Number: C0201-N.C.; Manufacturer Part Number: N.A.; Footprint Doc: 0201; LatestRevisionDate: 2014-11-13; Published: 2014-11-13; Value: N.C.; Artikkelnr Noca: N.A.; Part number IPS: N.A.; ComponentLink1URL: N.A.; ComponentLink1Description: Datasheet; ComponentLink2URL: N.A.; ComponentLink2Description: Supplier link; HelpURL: N.A.; Supplier 1: N.A.; Supplier Part Number 1: N.A.; Supplier 2: N.A.; Supplier Part Number 2: N.A.; Component Class: Capacitors; PartId: 100200001
R1 R2 = R0201-0R: Resistor, ±5%, 0.05W; Manufacturer: N.A.; Part number IPS: 00000003245; Note: Chip Res 5%; Pad Count: 2; Part Number: R0201-0R; Manufacturer Part Number: N.A.; Footprint Doc: 0201; LatestRevisionDate: 2017-11-09; Published: 2014-11-13; Value: 0R; Artikkelnr Noca: N.A.; ComponentLink1URL: N.A.; ComponentLink1Description: Datasheet; ComponentLink2URL: N.A.; ComponentLink2Description: Supplier link; HelpURL: N.A.; Supplier 1: N.A.; Supplier Part Number 1: N.A.; Supplier 2: N.A.; Supplier Part Number 2: N.A.; Component Class: Resistors; PartId: 100100001

## Sheet pca10100_sheet4_interface_mcu.SchDoc: PCA10100 - Interface MCU
size A3; Organization: Nordic Semiconductor; DocumentNumber: 4; Revision: 1.1.0; SheetNumber: 4; SheetTotal: 7; Author: RUBR; CompanyName: Nordic Semiconductor; DrawnBy: RUBR
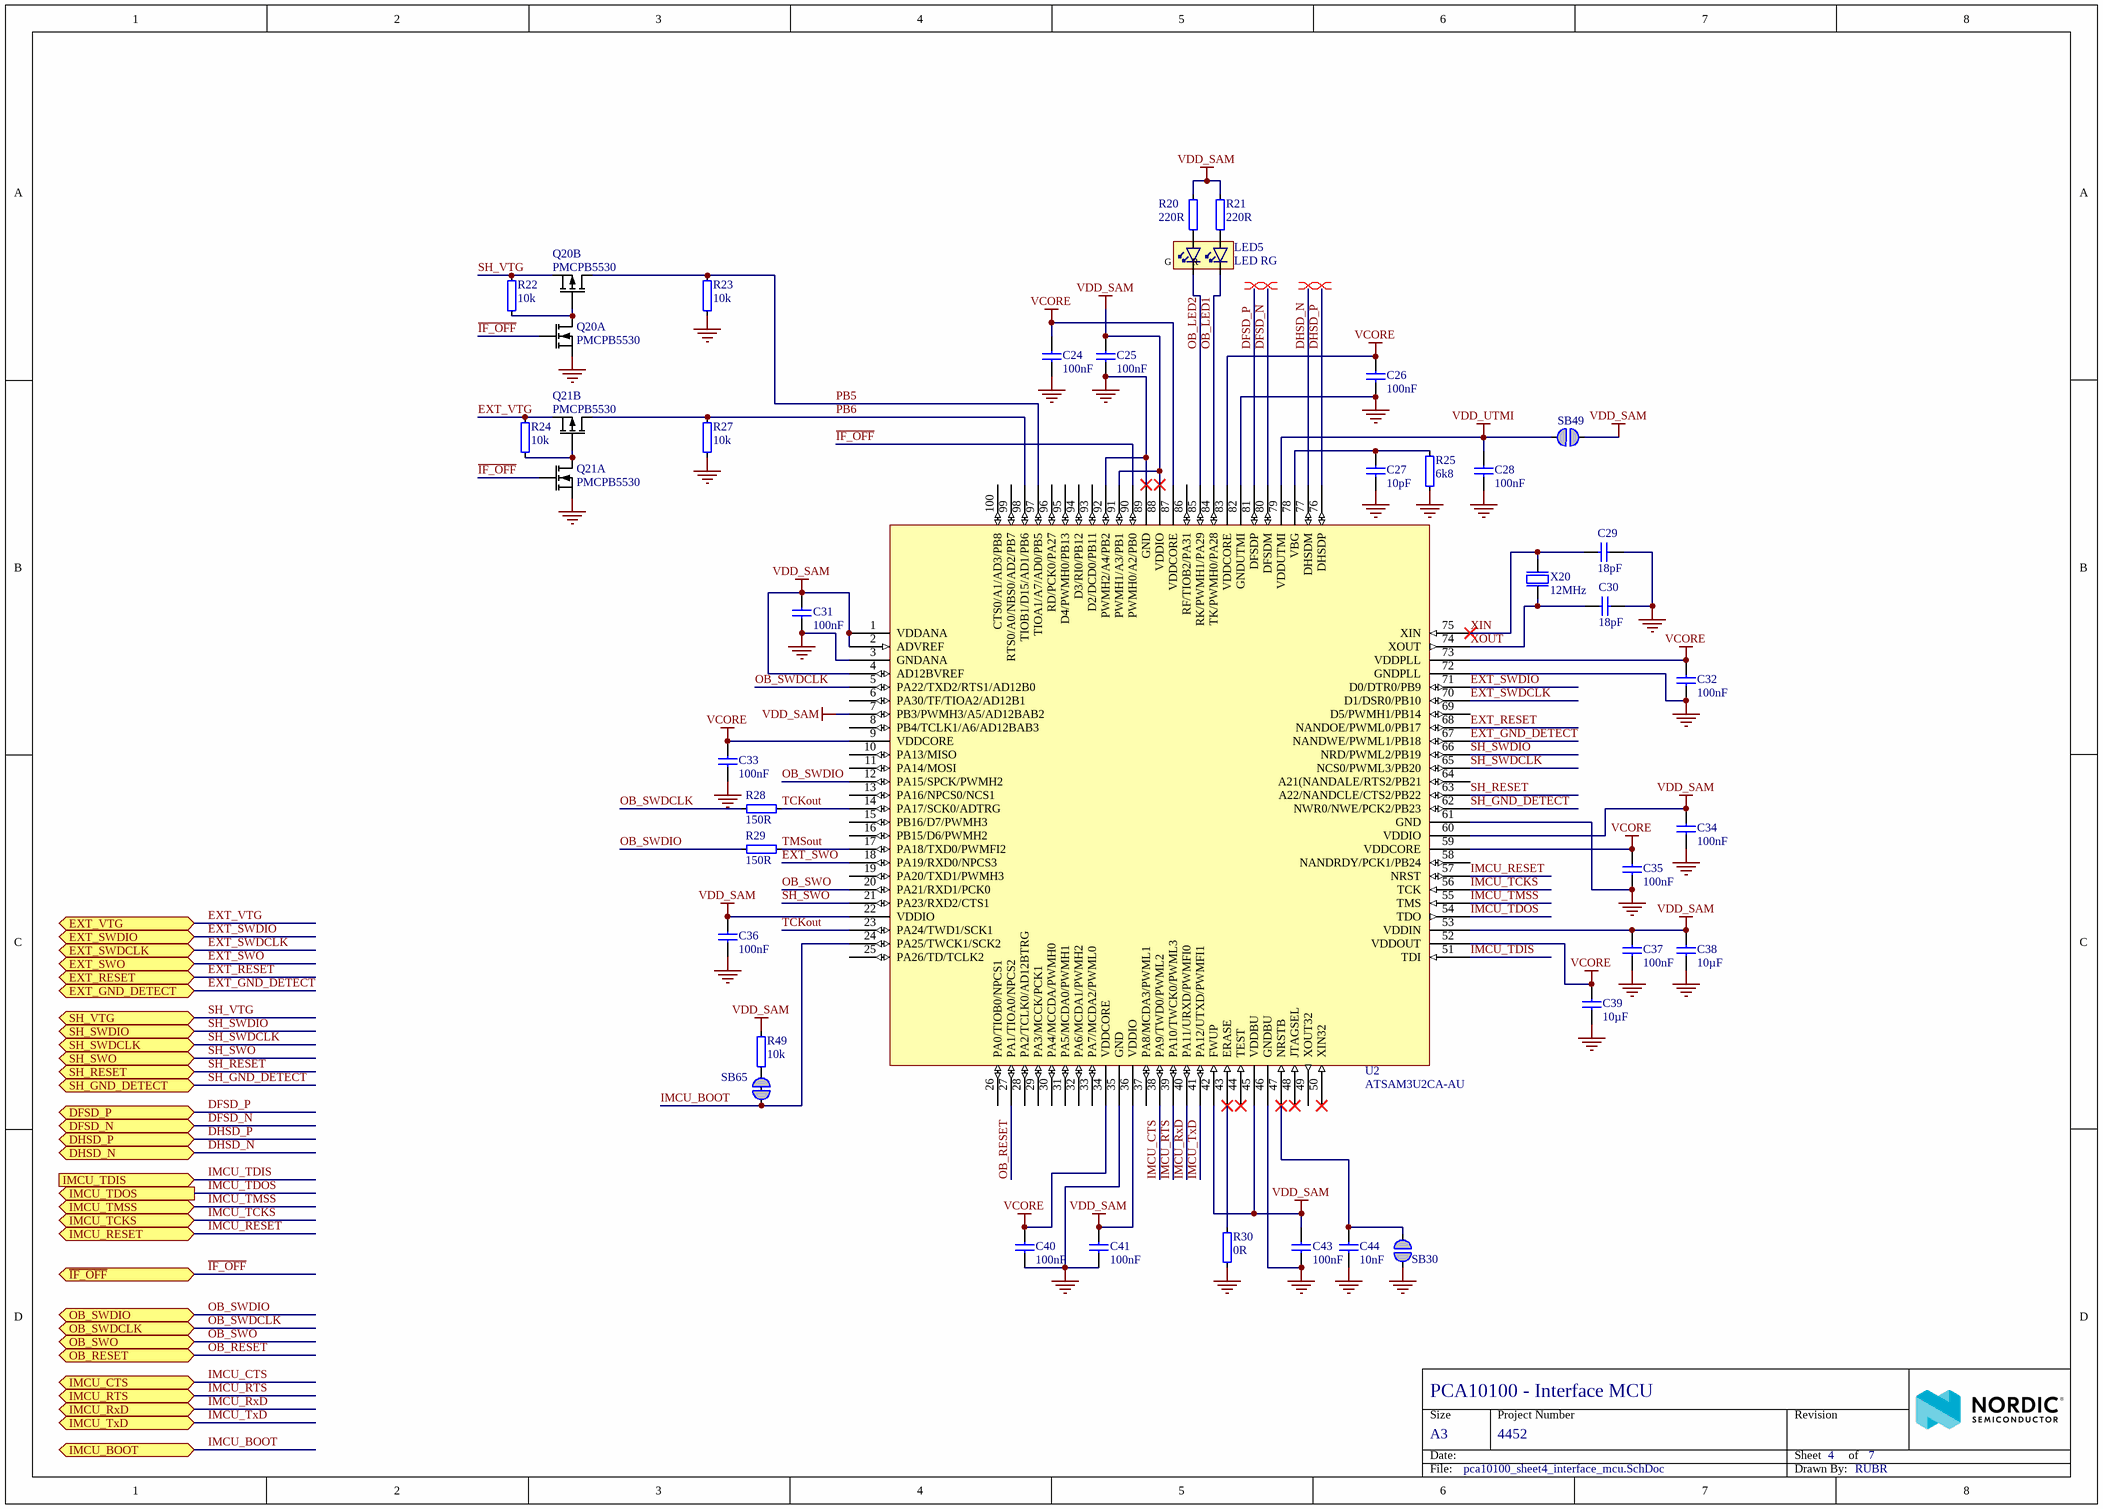
[diagram p3: pca10100_sheet4_interface_mcu.SchDoc]

### Parts
C24  100nF  [CAPC0603X03L_C]
C25  100nF  [CAPC0603X03L_C]
C26  100nF  [CAPC0603X03L_C]
C27  10pF  [CAPC0603X03L_C]
C28  100nF  [CAPC0603X03L_C]
C29  18pF  [CAPC0603X03L_C]
C30  18pF  [CAPC0603X03L_C]
C31  100nF  [CAPC0603X03L_C]
C32  100nF  [CAPC0603X03L_C]
C33  100nF  [CAPC0603X03L_C]
C34  100nF  [CAPC0603X03L_C]
C35  100nF  [CAPC0603X03L_C]
C36  100nF  [CAPC0603X03L_C]
C37  100nF  [CAPC0603X03L_C]
C38  10µF  [CAPC1608X06L]
C39  10µF  [CAPC1608X06L]
C40  100nF  [CAPC0603X03L_C]
C41  100nF  [CAPC0603X03L_C]
C43  100nF  [CAPC0603X03L_C]
C44  10nF  [CAPC0603X03L_C]
LED5  LED RG  [LED_DUAL_0606]
Q20  PMCPB5530  [DFN65P200X200X80_HS-6N]  (parts A,B of 2)
Q21  PMCPB5530  [PMCPB5530X]  (parts A,B of 2)
R20  220R  [RESC0603X03L_C]
R21  220R  [RESC0603X03L_C]
R22  10k  [RESC0603X03L_C]
R23  10k  [RESC0603X03L_C]
R24  10k  [RESC0603X03L_C]
R25  6k8  [RESC0603X03L_C]
R27  10k  [RESC0603X03L_C]
R28  150R  [RESC0603X03L_C]
R29  150R  [RESC0603X03L_C]
R30  0R  [RESC0603X03L_C]
R49  10k  [RESC0603X03L_C]
SB30  Solderbridge  [Solderbridge]  (value not drawn)  (no BOM)
SB49  Solderbridge  [Solderbridge]  (value not drawn)  (no BOM)
SB65  Solderbridge  [Solderbridge_Shorted]  (value not drawn)  (net tie, no BOM)
U2  ATSAM3U2CA-AU  [TSQFP50P1600X1600X160-100N]
X20  12MHz  [BT-XTAL_3225]

### Ports
DFSD_N (bidir), DFSD_P (bidir), DHSD_N (bidir), DHSD_P (bidir), EXT_GND_DETECT (bidir), EXT_RESET (bidir), EXT_SWDCLK (bidir), EXT_SWDIO (bidir), EXT_SWO (bidir), EXT_VTG (bidir), IMCU_BOOT (bidir), IMCU_CTS (bidir), IMCU_RESET (bidir), IMCU_RTS (bidir), IMCU_RxD (bidir), IMCU_TCKS (bidir), IMCU_TDIS (in), IMCU_TDOS (out), IMCU_TMSS (bidir), IMCU_TxD (bidir), OB_RESET (bidir), OB_SWDCLK (bidir), OB_SWDIO (bidir), OB_SWO (bidir), SH_GND_DETECT (bidir), SH_RESET (bidir), SH_SWDCLK (bidir), SH_SWDIO (bidir), SH_SWO (bidir), SH_VTG (bidir), ~{IF_OFF} (bidir)

### Nets
GND: C24.1 C25.1 C26.1 C27.1 C28.1 C29.2 C30.2 C31.1 C32.2 C33.1 C34.1 C35.1 C36.1 C37.1 C38.1 C39.1 C40.1 C41.1 C43.1 C44.1 Q20.1(S1) Q21.1(S1) R23.1 R25.1 R27.1 R30.1 SB30.2 U2.3(GNDANA) U2.35(GND) U2.46(GNDBU) U2.61(GND) U2.72(GNDPLL) U2.82(GNDUTMI) U2.89(GND) U2.92(PWMH2/A4/PB2) X20.2(GND) X20.4(GND)
VCORE: C24.2 C26.2 C32.1 C33.2 C35.2 C39.2 C40.2 U2.9(VDDCORE) U2.34(VDDCORE) U2.52(VDDOUT) U2.59(VDDCORE) U2.73(VDDPLL) U2.83(VDDCORE) U2.87(VDDCORE)
VDD_SAM: C25.2 C31.2 C34.2 C36.2 C37.2 C38.2 C41.2 C43.2 R20.2 R21.2 R49.2 SB49.1 U2.1(VDDANA) U2.2(ADVREF) U2.4(AD12BVREF) U2.7(PB3/PWMH3/A5/AD12BAB2) U2.22(VDDIO) U2.36(VDDIO) U2.42(FWUP) U2.45(VDDBU) U2.53(VDDIN) U2.60(VDDIO) U2.88(VDDIO) U2.91(PWMH1/A3/PB1)
VDD_UTMI: C28.2 SB49.2 U2.79(VDDUTMI)
DFSD_N: U2.80(DFSDM) ; port DFSD_N
DFSD_P: U2.81(DFSDP) ; port DFSD_P
DHSD_N: U2.77(DHSDM) ; port DHSD_N
DHSD_P: U2.76(DHSDP) ; port DHSD_P
EXT_GND_DETECT: U2.67(NANDWE/PWML1/PB18) ; port EXT_GND_DETECT
EXT_RESET: U2.68(NANDOE/PWML0/PB17) ; port EXT_RESET
EXT_SWDCLK: U2.70(D1/DSR0/PB10) ; port EXT_SWDCLK
EXT_SWDIO: U2.71(D0/DTR0/PB9) ; port EXT_SWDIO
EXT_SWO: U2.18(PA19/RXD0/NPCS3) ; port EXT_SWO
EXT_VTG: Q21.4(S2) R24.1 ; port EXT_VTG
~{IF_OFF}: Q20.2(G1) Q21.2(G1) U2.90(PWMH0/A2/PB0) ; port ~{IF_OFF}
IMCU_BOOT: SB65.1 U2.24(PA25/TWCK1/SCK2) ; port IMCU_BOOT
IMCU_CTS: U2.38(PA9/TWD0/PWML2) ; port IMCU_CTS
IMCU_RESET: U2.57(NRST) ; port IMCU_RESET
IMCU_RTS: U2.39(PA10/TWCK0/PWML3) ; port IMCU_RTS
IMCU_RxD: U2.40(PA11/URXD/PWMFI0) ; port IMCU_RxD
IMCU_TCKS: U2.56(TCK) ; port IMCU_TCKS
IMCU_TDIS: U2.51(TDI) ; port IMCU_TDIS
IMCU_TDOS: U2.54(TDO) ; port IMCU_TDOS
IMCU_TMSS: U2.55(TMS) ; port IMCU_TMSS
IMCU_TxD: U2.41(PA12/UTXD/PWMFI1) ; port IMCU_TxD
OB_LED1: LED5.4(C1) U2.84(TK/PWMH0/PA28)
OB_LED2: LED5.3(C2) U2.85(RK/PWMH1/PA29)
OB_RESET: U2.27(PA1/TIOA0/NPCS2) ; port OB_RESET
OB_SWDCLK: R28.2 U2.5(PA22/TXD2/RTS1/AD12B0) ; port OB_SWDCLK
OB_SWDIO: R29.2 U2.12(PA15/SPCK/PWMH2) ; port OB_SWDIO
OB_SWO: U2.20(PA21/RXD1/PCK0) ; port OB_SWO
PB5: Q20.3(D2) R23.2 U2.97(TIOA1/A7/AD0/PB5)
PB6: Q21.3(D2) R27.2 U2.98(TIOB1/D15/AD1/PB6)
SH_GND_DETECT: U2.62(NWR0/NWE/PCK2/PB23) ; port SH_GND_DETECT
SH_RESET: U2.63(A22/NANDCLE/CTS2/PB22) ; port SH_RESET
SH_SWDCLK: U2.65(NCS0/PWML3/PB20) ; port SH_SWDCLK
SH_SWDIO: U2.66(NRD/PWML2/PB19) ; port SH_SWDIO
SH_SWO: U2.21(PA23/RXD2/CTS1) ; port SH_SWO
SH_VTG: Q20.4(S2) R22.1 ; port SH_VTG
TCKout: R28.1 U2.14(PA17/SCK0/ADTRG) U2.23(PA24/TWD1/SCK1)
TMSout: R29.1 U2.17(PA18/TXD0/PWMFI2)
XIN: C29.1 U2.75(XIN) X20.3(out)
XOUT: C30.1 U2.74(XOUT) X20.1(inp)
NetC27_2: C27.2 R25.2 U2.78(VBG)
NetC44_2: C44.2 SB30.1 U2.47(NRSTB)
NetLED5_1: LED5.1(A2) R20.1
NetLED5_2: LED5.2(A1) R21.1
NetQ20_5: Q20.5(G2) Q20.6(D1) R22.2
NetQ21_5: Q21.5(G2) Q21.6(D1) R24.2
NetR30_2: R30.2 U2.43(ERASE)
NetR49_1: R49.1 SB65.2

Not connected (* = marked no-connect by the designer): U2 6(PA30/TF/TIOA2/AD12B1) 8(PB4/TCLK1/A6/AD12BAB3) 10(PA13/MISO) 11(PA14/MOSI) 13(PA16/NPCS0/NCS1) 15(PB16/D7/PWMH3) 16(PB15/D6/PWMH2) 19(PA20/TXD1/PWMH3) 25(PA26/TD/TCLK2) 26(PA0/TIOB0/NPCS1) 28(PA2/TCLK0/AD12BTRG) 29(PA3/MCCK/PCK1) 30(PA4/MCCDA/PWMH0) 31(PA5/MCDA0/PWMH1) 32(PA6/MCDA1/PWMH2) 33(PA7/MCDA2/PWML0) 37(PA8/MCDA3/PWML1) 44(TEST)* 48(JTAGSEL)* 49(XOUT32) 50(XIN32)* 58(NANDRDY/PCK1/PB24) 64(A21(NANDALE/RTS2/PB21) 69(D5/PWMH1/PB14) 86(RF/TIOB2/PA31) 93(D2/DCD0/PB11) 94(D3/RI0/PB12) 95(D4/PWMH0/PB13) 96(RD/PCK0/PA27) 99(RTS0/A0/NBS0/AD2/PB7) 100(CTS0/A1/AD3/PB8)

### Layout directives
differential pair: DFSD_N, DFSD_P, DHSD_N, DHSD_P

### Notes on the sheet
- Size
- Date:
- A3
- Project Number
- Sheet         of
- Revision
- File:
- Drawn By:
- (in symbol LTST-C195KGJRKT) G; R

### Library data of the parts
C24-C26 C28 C31-C37 C40 C41 C43 = C0201-100n: Capacitor, X5R, ±10%; Manufacturer: N.A.; Part number IPS: 00000001248, 00000002505; Note: 16V; Pad Count: 2; Part Number: C0201-100n; Manufacturer Part Number: N.A.; LatestRevisionDate: 2017-11-09; Published: 2014-11-13; Value: 100nF; Artikkelnr Noca: N.A.; Footprint Doc: 0201; ComponentLink1URL: N.A.; ComponentLink1Description: Datasheet; ComponentLink2URL: N.A.; ComponentLink2Description: Supplier link; HelpURL: N.A.; Supplier 1: N.A.; Supplier Part Number 1: N.A.; Supplier 2: N.A.; Supplier Part Number 2: N.A.; Component Class: Capacitors; PartId: 100200078
C27 = C0201-10p: Capacitor, C0G, ±5%, 25V; Manufacturer: N.A.; Part number IPS: 00000003191; Note: Chip Cap 1%; Pad Count: 2; Part Number: C0201-10p; Manufacturer Part Number: N.A.; LatestRevisionDate: 2020-10-13; Published: 2014-11-13; Value: 10pF; Artikkelnr Noca: N.A.; Footprint Doc: 0201; ComponentLink1URL: N.A.; ComponentLink1Description: Datasheet; ComponentLink2URL: N.A.; ComponentLink2Description: Supplier link; HelpURL: N.A.; Supplier 1: N.A.; Supplier Part Number 1: N.A.; Supplier 2: N.A.; Supplier Part Number 2: N.A.; Component Class: Capacitors; PartId: 100200032
C29 C30 = C0201-18p: Capacitor, C0G, ±5%, 25V; Manufacturer: N.A.; Part number IPS: 00000000862; Note: Chip Cap 1%; Pad Count: 2; Part Number: C0201-18p; Manufacturer Part Number: N.A.; LatestRevisionDate: 2020-10-13; Published: 2014-11-13; Value: 18pF; Artikkelnr Noca: N.A.; Footprint Doc: 0201; ComponentLink1URL: N.A.; ComponentLink1Description: Datasheet; ComponentLink2URL: N.A.; ComponentLink2Description: Supplier link; HelpURL: N.A.; Supplier 1: N.A.; Supplier Part Number 1: N.A.; Supplier 2: N.A.; Supplier Part Number 2: N.A.; Component Class: Capacitors; PartId: 100200035
C38 C39 = C0603-10µ: Capacitor, X5R, ±20%; Manufacturer: N.A.; Part number IPS: 00000007785; Note: 6.3V; Artikkelnr Noca: 20039234; Pad Count: 2; Part Number: C0603-10µ; Manufacturer Part Number: N.A.; LatestRevisionDate: 2011-01-17; Published: 2011-01-17; Value: 10µF; Footprint Doc: 0603; ComponentLink1URL: N.A.; ComponentLink1Description: Datasheet; ComponentLink2URL: N.A.; ComponentLink2Description: Supplier link; HelpURL: N.A.; Supplier 1: N.A.; Supplier Part Number 1: N.A.; Supplier 2: N.A.; Supplier Part Number 2: N.A.; Component Class: Capacitors; PartId: 100200275
C44 = C0201-10n: Capacitor, X7R, ±10%; Manufacturer: N.A.; Part number IPS: 00000003480; Note: 10V; Pad Count: 2; Part Number: C0201-10n; Manufacturer Part Number: N.A.; LatestRevisionDate: 2017-11-09; Published: 2014-11-13; Value: 10nF; Artikkelnr Noca: N.A.; Footprint Doc: 0201; ComponentLink1URL: N.A.; ComponentLink1Description: Datasheet; ComponentLink2URL: N.A.; ComponentLink2Description: Supplier link; HelpURL: N.A.; Supplier 1: N.A.; Supplier Part Number 1: N.A.; Supplier 2: N.A.; Supplier Part Number 2: N.A.; Component Class: Capacitors; PartId: 100200067
LED5 = LTST-C195KGJRKT: Ultra bright AlInGaP Bi-Color LED; Manufacturer: Lite-On Inc; Part number IPS: 00000009962; Note: N.A.; Artikkelnr Noca: 13019145; Pad Count: 4; Part Number: LTST-C195KGJRKT; Manufacturer Part Number: LTST-C195KGJRKT; LatestRevisionDate: 2013-02-11; Published: 2012-07-05; Value: LED RG; Footprint Doc: LED_DUAL_0606; ComponentLink1URL: N.A.; ComponentLink1Description: Datasheet; ComponentLink2URL: N.A.; ComponentLink2Description: Supplier link; HelpURL: http://media.digikey.com/pdf/Data%20Sheets/Lite-On%20PDFs/LTST-C195KGJRKT.pdf; Supplier 1: Digi-Key; Supplier Part Number 1: 160-1452-1-ND; Supplier 2: Mouser; Supplier Part Number 2: 859-LTST-C195KGJRKT; Component Class: Optoelectronics; PartId: 101400088
Q20 Q21 = PMCPB5530X,115: Mosfet Array N and P-Channel 20V 4A (Ta), 3.4A (Ta) 490mW Surface Mount 6-HUSON-EP (2x2); Manufacturer: Nexperia; Part number IPS: 00000001918; Note: N.A.; Pad Count: 8; Part Number: PMCPB5530X,115; Manufacturer Part Number: PMCPB5530X,115; LatestRevisionDate: 2018-04-30; Published: 2018-04-30; Value: PMCPB5530; Artikkelnr Noca: N.A.; Footprint Doc: 6-UDFN; ComponentLink1URL: https://assets.nexperia.com/documents/data-sheet/PMCPB5530X.pdf; ComponentLink1Description: Datasheet; ComponentLink2URL: https://www.digikey.com/product-detail/en/nexperia-usa-inc/PMCPB5530X115/1727-1327-1-ND/4386339; ComponentLink2Description: Supplier link; HelpURL: https://www.nexperia.com/products/mosfets/small-signal-mosfets/PMCPB5530X.html; Supplier 1: Digi-Key; Supplier Part Number 1: 1727-1327-1-ND; Supplier 2: Mouser; Supplier Part Number 2: 771-PMCPB5530X115; Component Class: Semiconductors; PartId: 101300165
R20 R21 = R0201-220: Resistor, ±1%, 0.05W; Manufacturer: N.A.; Part number IPS: 00000000863; Note: Chip Res 1%; Pad Count: 2; Part Number: R0201-220; Manufacturer Part Number: N.A.; LatestRevisionDate: 2014-11-13; Published: 2014-11-13; Value: 220R; Artikkelnr Noca: N.A.; Footprint Doc: 0201; ComponentLink1URL: N.A.; ComponentLink1Description: Datasheet; ComponentLink2URL: N.A.; ComponentLink2Description: Supplier link; HelpURL: N.A.; Supplier 1: N.A.; Supplier Part Number 1: N.A.; Supplier 2: N.A.; Supplier Part Number 2: N.A.; Component Class: Resistors; PartId: 100100032
R22-R24 R27 R49 = R0201-10k: Resistor, ±1%, 0.05W; Manufacturer: N.A.; Part number IPS: 00000001255; Note: Chip Res 1%; Pad Count: 2; Part Number: R0201-10k; Manufacturer Part Number: N.A.; LatestRevisionDate: 2014-11-13; Published: 2014-11-13; Value: 10k; Artikkelnr Noca: N.A.; Footprint Doc: 0201; ComponentLink1URL: N.A.; ComponentLink1Description: Datasheet; ComponentLink2URL: N.A.; ComponentLink2Description: Supplier link; HelpURL: N.A.; Supplier 1: N.A.; Supplier Part Number 1: N.A.; Supplier 2: N.A.; Supplier Part Number 2: N.A.; Component Class: Resistors; PartId: 100100065
R25 = R0201-6k8: Resistor, ±1%, 0.05W; Manufacturer: N.A.; Part number IPS: 00000001705; Note: Chip Res 1%; Pad Count: 2; Part Number: R0201-6k8; Manufacturer Part Number: N.A.; LatestRevisionDate: 2014-11-13; Published: 2014-11-13; Value: 6k8; Artikkelnr Noca: N.A.; Footprint Doc: 0201; ComponentLink1URL: N.A.; ComponentLink1Description: Datasheet; ComponentLink2URL: N.A.; ComponentLink2Description: Supplier link; HelpURL: N.A.; Supplier 1: N.A.; Supplier Part Number 1: N.A.; Supplier 2: N.A.; Supplier Part Number 2: N.A.; Component Class: Resistors; PartId: 100100063
R28 R29 = R0201-150: Resistor, ±1%, 0.05W; Manufacturer: N.A.; Part number IPS: 00000001420; Note: Chip Res 1%; Pad Count: 2; Part Number: R0201-150; Manufacturer Part Number: N.A.; LatestRevisionDate: 2014-11-13; Published: 2014-11-13; Value: 150R; Artikkelnr Noca: N.A.; Footprint Doc: 0201; ComponentLink1URL: N.A.; ComponentLink1Description: Datasheet; ComponentLink2URL: N.A.; ComponentLink2Description: Supplier link; HelpURL: N.A.; Supplier 1: N.A.; Supplier Part Number 1: N.A.; Supplier 2: N.A.; Supplier Part Number 2: N.A.; Component Class: Resistors; PartId: 100100029
R30 = R0201-0R: as R1 on sheet pca10100_sheet3_pin_map; Part Number: R0201-0R; Manufacturer Part Number: N.A.; LatestRevisionDate: 2017-11-09; Published: 2014-11-13; Value: 0R; Artikkelnr Noca: N.A.; Footprint Doc: 0201; ComponentLink1URL: N.A.; ComponentLink1Description: Datasheet; ComponentLink2URL: N.A.; ComponentLink2Description: Supplier link; HelpURL: N.A.; Supplier 1: N.A.; Supplier Part Number 1: N.A.; Supplier 2: N.A.; Supplier Part Number 2: N.A.; Component Class: Resistors; PartId: 100100001
SB30 SB49 = Solderbridge: Manufacturer: N.A.; Pad Count: 2; Part Number: Solderbridge; Manufacturer Part Number: N.A.; LatestRevisionDate: 2009-12-14; Published: 2009-12-14; Value: Solderbridge; Note: N.A.; Artikkelnr Noca: N.A.; Footprint Doc: Solderbridge; Part number IPS: N.A.; ComponentLink1URL: N.A.; ComponentLink1Description: Datasheet; ComponentLink2URL: N.A.; ComponentLink2Description: Supplier link; HelpURL: N.A.; Supplier 1: N.A.; Supplier Part Number 1: N.A.; Supplier 2: N.A.; Supplier Part Number 2: N.A.; Component Class: Connectors; PartId: 100500458
SB65 = Solderbridge Shorted: as SB1 on sheet pca10100_sheet2_nrf52833_mcu; Part Number: Solderbridge Shorted; Manufacturer Part Number: N.A.; LatestRevisionDate: 2012-08-07; Published: 2012-08-07; Value: Solderbridge; Note: N.A.; Artikkelnr Noca: N.A.; Footprint Doc: Solderbridge_Shorted; Part number IPS: N.A.; ComponentLink1URL: N.A.; ComponentLink1Description: Datasheet; ComponentLink2URL: N.A.; ComponentLink2Description: Supplier link; HelpURL: N.A.; Supplier 1: N.A.; Supplier Part Number 1: N.A.; Supplier 2: N.A.; Supplier Part Number 2: N.A.; Component Class: Connectors; PartId: 100500459
U2 = ATSAM3U2CA-AU: IC MCU 32bit 128kB flash 100LQFP; Manufacturer: Atmel; Part number IPS: 00000009985; Note: N.A.; Artikkelnr Noca: 15019073; Pad Count: 100; Part Number: ATSAM3U2CA-AU; Manufacturer Part Number: ATSAM3U2CA-AU; LatestRevisionDate: 2012-06-01; Published: 2012-06-01; Value: ATSAM3U2CA-AU; Footprint Doc: LQFP-100; ComponentLink1URL: N.A.; ComponentLink1Description: Datasheet; ComponentLink2URL: N.A.; ComponentLink2Description: Supplier link; HelpURL: http://www.atmel.com/Images/6430s.pdf; Supplier 1: Digi-Key; Supplier Part Number 1: ATSAM3U2CA-AU-ND; Supplier 2: Farnell; Supplier Part Number 2: 184-1662; Component Class: Misc_ICs; PartId: 101900036
X20 = XTAL_SMD3225_12MHz_18pF_TXC: XTAL SMD 3225, 12MHz, Cl=18pF, Tol: ±30ppm, Stab: ±30ppm; Manufacturer: TXC Corporation; Manufacturer Part Number: 7M-12.000MAAJ-T; Part number IPS: 00000009994; Note: XTAL SMD 12.000MHz; Artikkelnr Noca: 22019166; Pad Count: 4; Part Number: XTAL_SMD3225_12MHz_18pF_TXC; LatestRevisionDate: 2014-11-27; Published: 2010-08-31; Value: 12MHz; Footprint Doc: XTAL_3225; ComponentLink1URL: N.A.; ComponentLink1Description: Datasheet; ComponentLink2URL: N.A.; ComponentLink2Description: Supplier link; HelpURL: http://www.txccrystal.com/images/pdf/7m.pdf; Supplier 1: Digi-Key; Supplier Part Number 1: 887-1121-1-ND; Supplier 2: Farnell; Supplier Part Number 2: 184-2056; Component Class: Oscillators; PartId: 101600056